# Altium schematic sheet Connector.SchDoc
size A
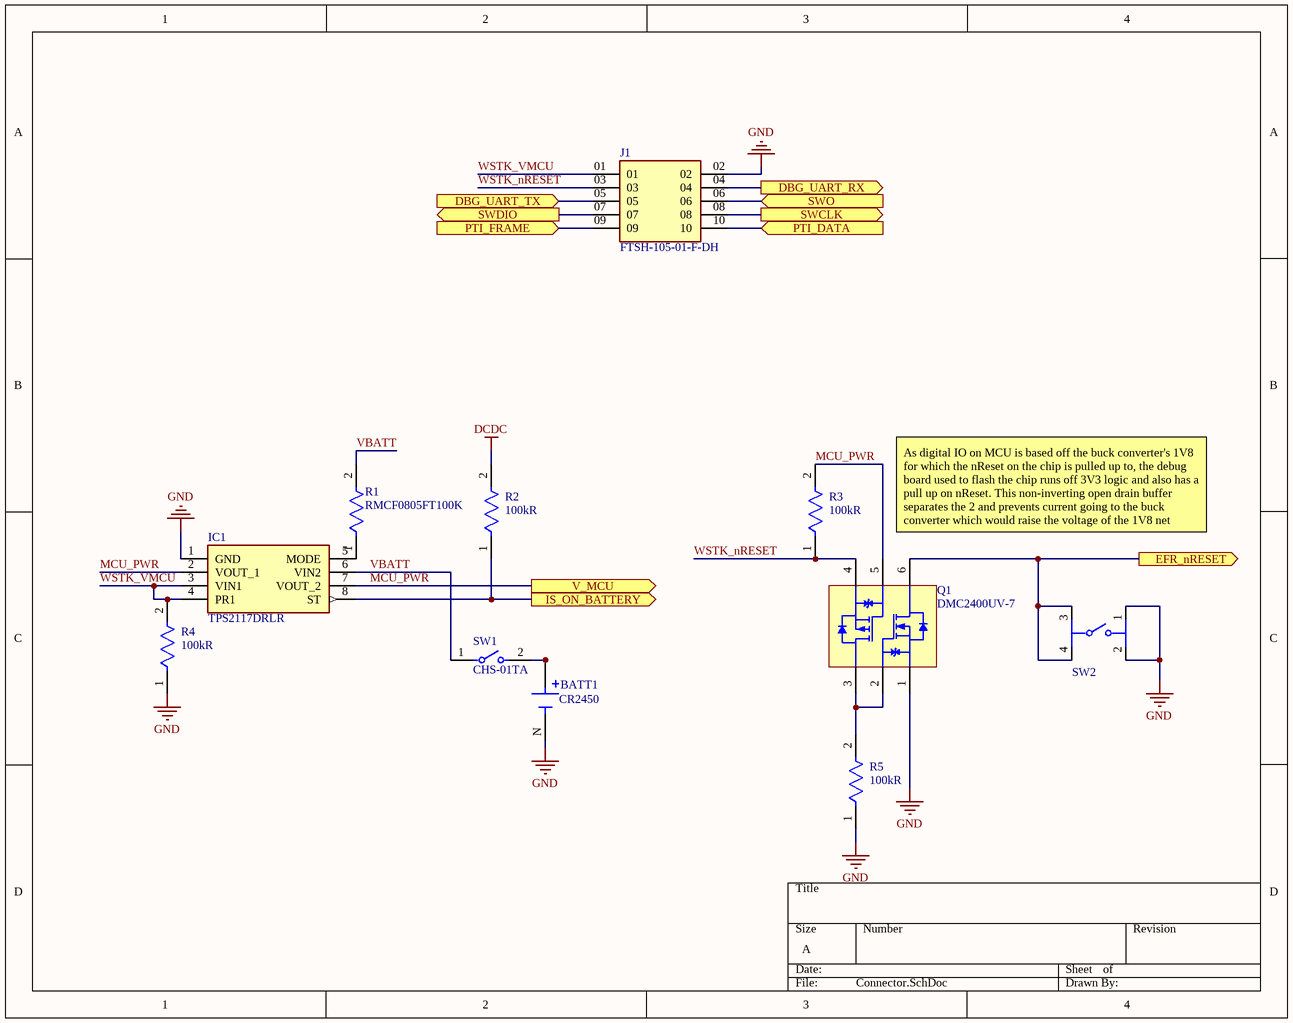
[diagram p0: Connector.SchDoc]

## Parts
BATT1  Battery: CR2450  [BAT_3009]  (hidden comment: 3009)
IC1  TPS2117DRLR  [SOTFL50P160X60-8N]
J1  FTSH-105-01-F-DH  [SimplicityStudio]
Q1  DMC2400UV-7  [DIOD-SOT563-6_V]
R1  RMCF0805FT100K  [FP-RMCF0805-IPC_C]
R2  Resistance: 100kR  [FP-RMCF0805-IPC_C]  (hidden comment: RMCF0805FT100K)
R3  Resistance: 100kR  [FP-RMCF0805-IPC_C]  (hidden comment: RMCF0805FT100K)
R4  Resistance: 100kR  [FP-RMCF0805-IPC_C]  (hidden comment: RMCF0805FT100K)
R5  Resistance: 100kR  [FP-RMCF0805-IPC_C]  (hidden comment: RMCF0805FT100K)
SW1  CHS-01TA  [FP-CHS-01TA-MFG]
SW2  PTS810SJM250SMTRLFS  [FP-PTS810SJM250SMTRLFS-MFG]  (value not drawn)

## Ports
DBG_UART_RX (out), DBG_UART_TX (in), EFR_nRESET (out), IS_ON_BATTERY (out), PTI_DATA (in), PTI_FRAME (in), SWCLK (out), SWDIO (out), SWO (in), V_MCU (out)

## Nets
DCDC: R2.2
GND: BATT1.N(NEG) IC1.1(GND) J1.02 Q1.1(S1) R4.1 R5.1 SW2.1 SW2.2
DBG_UART_RX: J1.04 ; port DBG_UART_RX
DBG_UART_TX: J1.05 ; port DBG_UART_TX
EFR_nRESET: Q1.6(D1) SW2.3 SW2.4 ; port EFR_nRESET
IS_ON_BATTERY: IC1.8(ST) R2.1 ; port IS_ON_BATTERY
MCU_PWR: IC1.2(VOUT_1) IC1.7(VOUT_2) Q1.5(G2) R3.2 ; port V_MCU
PTI_DATA: J1.10 ; port PTI_DATA
PTI_FRAME: J1.09 ; port PTI_FRAME
SWCLK: J1.08 ; port SWCLK
SWDIO: J1.07 ; port SWDIO
SWO: J1.06 ; port SWO
VBATT: IC1.6(VIN2) R1.2 SW1.1
WSTK_nRESET: J1.03 Q1.4(S2) R3.1
WSTK_VMCU: IC1.3(VIN1) IC1.4(PR1) J1.01 R4.2
NetBATT1_P1: BATT1.P1(POS) BATT1.P2(POS) SW1.2
NetIC1_5: IC1.5(MODE) R1.1
NetQ1_2: Q1.2(G1) Q1.3(D2) R5.2

## Notes on the sheet
- As digital IO on MCU is based off the buck converter's 1V8 for which the nReset on the chip is pulled up to, the debug board used to flash the chip runs off 3V3 logic and also has a pull up on nReset. This non-inverting open drain buffer separates the 2 and prevents current going to the buck converter which would raise the voltage of the 1V8 net

## Library data of the parts
BATT1 = CMP-010-000000-2: CR2450 Retainer; Pin Count: 3; Price: None; Availability: Unavailable; Package: None; Component Type: Standard; MP: 3009; Source: 3009.SchLib; Value: *; Design Item ID: 3009
IC1 = TPS2117DRLR: Integrated Circuit; Manufacturer_Name: Texas Instruments; Datasheet Link: https://www.ti.com/lit/ds/symlink/tps2117.pdf?ts=1704705133749&ref_url=https%253A%252F%252Fwww.ti.com%252Fproduct%252FTPS2117; Height: 0.6mm; Manufacturer_Part_Number: TPS2117DRLR; Mouser Part Number: 595-TPS2117DRLR; Mouser Price/Stock: https://www.mouser.co.uk/ProductDetail/Texas-Instruments/TPS2117DRLR?qs=HoCaDK9Nz5c%2FKe5lpCPPWQ%3D%3D
J1 = SimplicityStudio
Q1 = CMP-2000-06168-1: Complementary Pair Enhancement Mode MOSFET, 20 V N-Channel, -20 V P-Channel, -55 to 150 degC, 6-Pin SOTFL (SOT563), RoHS, Tape and Reel; Manufacturer: Diodes Inc; Channel Type: N,P; Maximum Power Dissipation: 1W; Typical Gate Charge @ Vgs: 0.5nC@4.5V; Typical Input Capacitance @ Vds: 37.1pF@10V; Maximum Gate Source Voltage: ±12(Q1)V,±8(Q2)V; Maximum Drain Source Resistance: 1.5Ω; Transistor Material: Si; Maximum Continuous Drain Current: 0.7A,1A; Typical Turn-Off Delay Time: 13.74ns; Number of Elements per Chip: 2; Maximum Drain Source Voltage: 20V; Maximum Gate Threshold Voltage: 1V; Transistor Configuration: Isolated; Typical Turn-On Delay Time: 4.06ns; Length: 1.7mm; Height: 0.6mm; Width: 1.25mm; Pin Count: 6; Minimum Operating Temperature: -55°C; Dimensions: 1.7x1.25x0.6mm; Package Type: SOT-563; Category: PowerMOSFET; Maximum Operating Temperature: +150°C; Manufacturer URL: http://www.diodes.com/; Channel Mode: Enhancement; Package Reference: SOT563-6; Mounting Technology: SurfaceMount; Datasheet URL: http://www.diodes.com/_files/datasheets/DMC2400UV.pdf; Package Description: 6-Pin Small Outline Transistor, Flat Lead, Body 1.175 x 1.6 mm, Pitch 0.5 mm; Mounting Type: SurfaceMount; Datasheet Version: Rev. 7-2, 06/2013
R1 = CMP-26527-001446-1: 100kΩ ±1% 0.125W 0805 Thick Film Chip Resistor AEC-Q200 compliant; Temperature Coefficient: 100ppm/°C; Resistance: 100kR; Working Voltage: 150V; Power Rating: 125mW; Resistor Type: Thick Film; Length: 2mm; Depth: 1.25mm; Technology: THICK FILM; Construction: Rectangular; Packaging: Tape and Reel; Contact Plating: Tin; Series: RMCF; Min Operating Temperature: -55°C; Features: Automotive AEC-Q200; Mount: Surface Mount; Height: 0.026inch; Case Code (Metric): 2012; Case/Package: 0805; Width: 0.049inch; Number of Terminations: 2; Radiation Hardening: No; Max Operating Temperature: 155°C; Lead Free: Lead Free; Military Standard: Not; Max Power Dissipation: 125mW; Case Code (Imperial): 0805; RoHS Compliant: Yes; Tolerance: 1%
R2-R5 = CMP-26527-001446-1: 100kΩ ±1% 0.125W 0805 Thick Film Chip Resistor AEC-Q200 compliant; Temperature Coefficient: 100ppm/°C; Working Voltage: 150V; Power Rating: 125mW; Resistor Type: Thick Film; Length: 2mm; Depth: 1.25mm; Technology: THICK FILM; Construction: Rectangular; Packaging: Tape and Reel; Contact Plating: Tin; Series: RMCF; Min Operating Temperature: -55°C; Features: Automotive AEC-Q200; Mount: Surface Mount; Height: 0.026inch; Case Code (Metric): 2012; Case/Package: 0805; Width: 0.049inch; Number of Terminations: 2; Radiation Hardening: No; Max Operating Temperature: 155°C; Lead Free: Lead Free; Military Standard: Not; Max Power Dissipation: 125mW; Case Code (Imperial): 0805; RoHS Compliant: Yes; Tolerance: 1%
SW1 = CMP-71740-000003-1: SWITCH SLIDE DIP SPST 100MA 6V; Manufacturer: Nidec Copal Electronics; Contact Resistance: 50mΩ; Standoff Height: 0mm; Number Of Circuits: 1; Electromechanical Life: 2000Cycles; Device Class L1: Electromechanical; Device Class L2: Switches; Category: Switch; Temperature Range Low: -40°C; Device Class L3: DIP Switches; Height: 2.5mm; Lead Free: Yes; Octopart: https://octopart.com/chs-01ta-nidec+copal-52304644; Throw Configuration: SPST; Package: CHS-01TA; Voltage Rating Dc: 6V; Digikey Description: SWITCH SLIDE DIP SPST 100MA 6V; Mount: Surface Mount; Automotive: No; Contact Current Rating: 100mA; ComponentLink2URL: https://www.nidec-copal-electronics.com/e/catalog/switch/chs.pdf; ComponentLink2Description: Datasheet; Temperature: -40°C to +85°C; Temperature Range High: +85°C; RoHS: TRUE; Manufacturer Part Number: CHS-01TA
SW2 = CMP-10040-000001-2: SWITCH TACTILE SPST-NO 0.05A 16V; Throw Configuration: SPST; Operating Force: 160gf; Actuator Type: Standard; Switch Travel: 0.15mm; Switch Function: Off-Mom; Max Current Rating: 50mA; Mechanical Life: 150000Cycles; Illumination Type: Non-Illuminated; Package Quantity: 2900; Depth: 4.6mm; Mount: Surface Mount; Packaging: Tape and Reel; Length: 3.2mm; RoHS Compliant: Yes; Case/Package: SMD/SMT; Voltage Rating (DC): 16V; Min Operating Temperature: -40°C; Termination: J-Bend; Lead Free: Lead Free; Contact Plating: Silver; Orientation: Straight; Max Operating Temperature: 85°C; Current Rating: 50mA; Color: Black